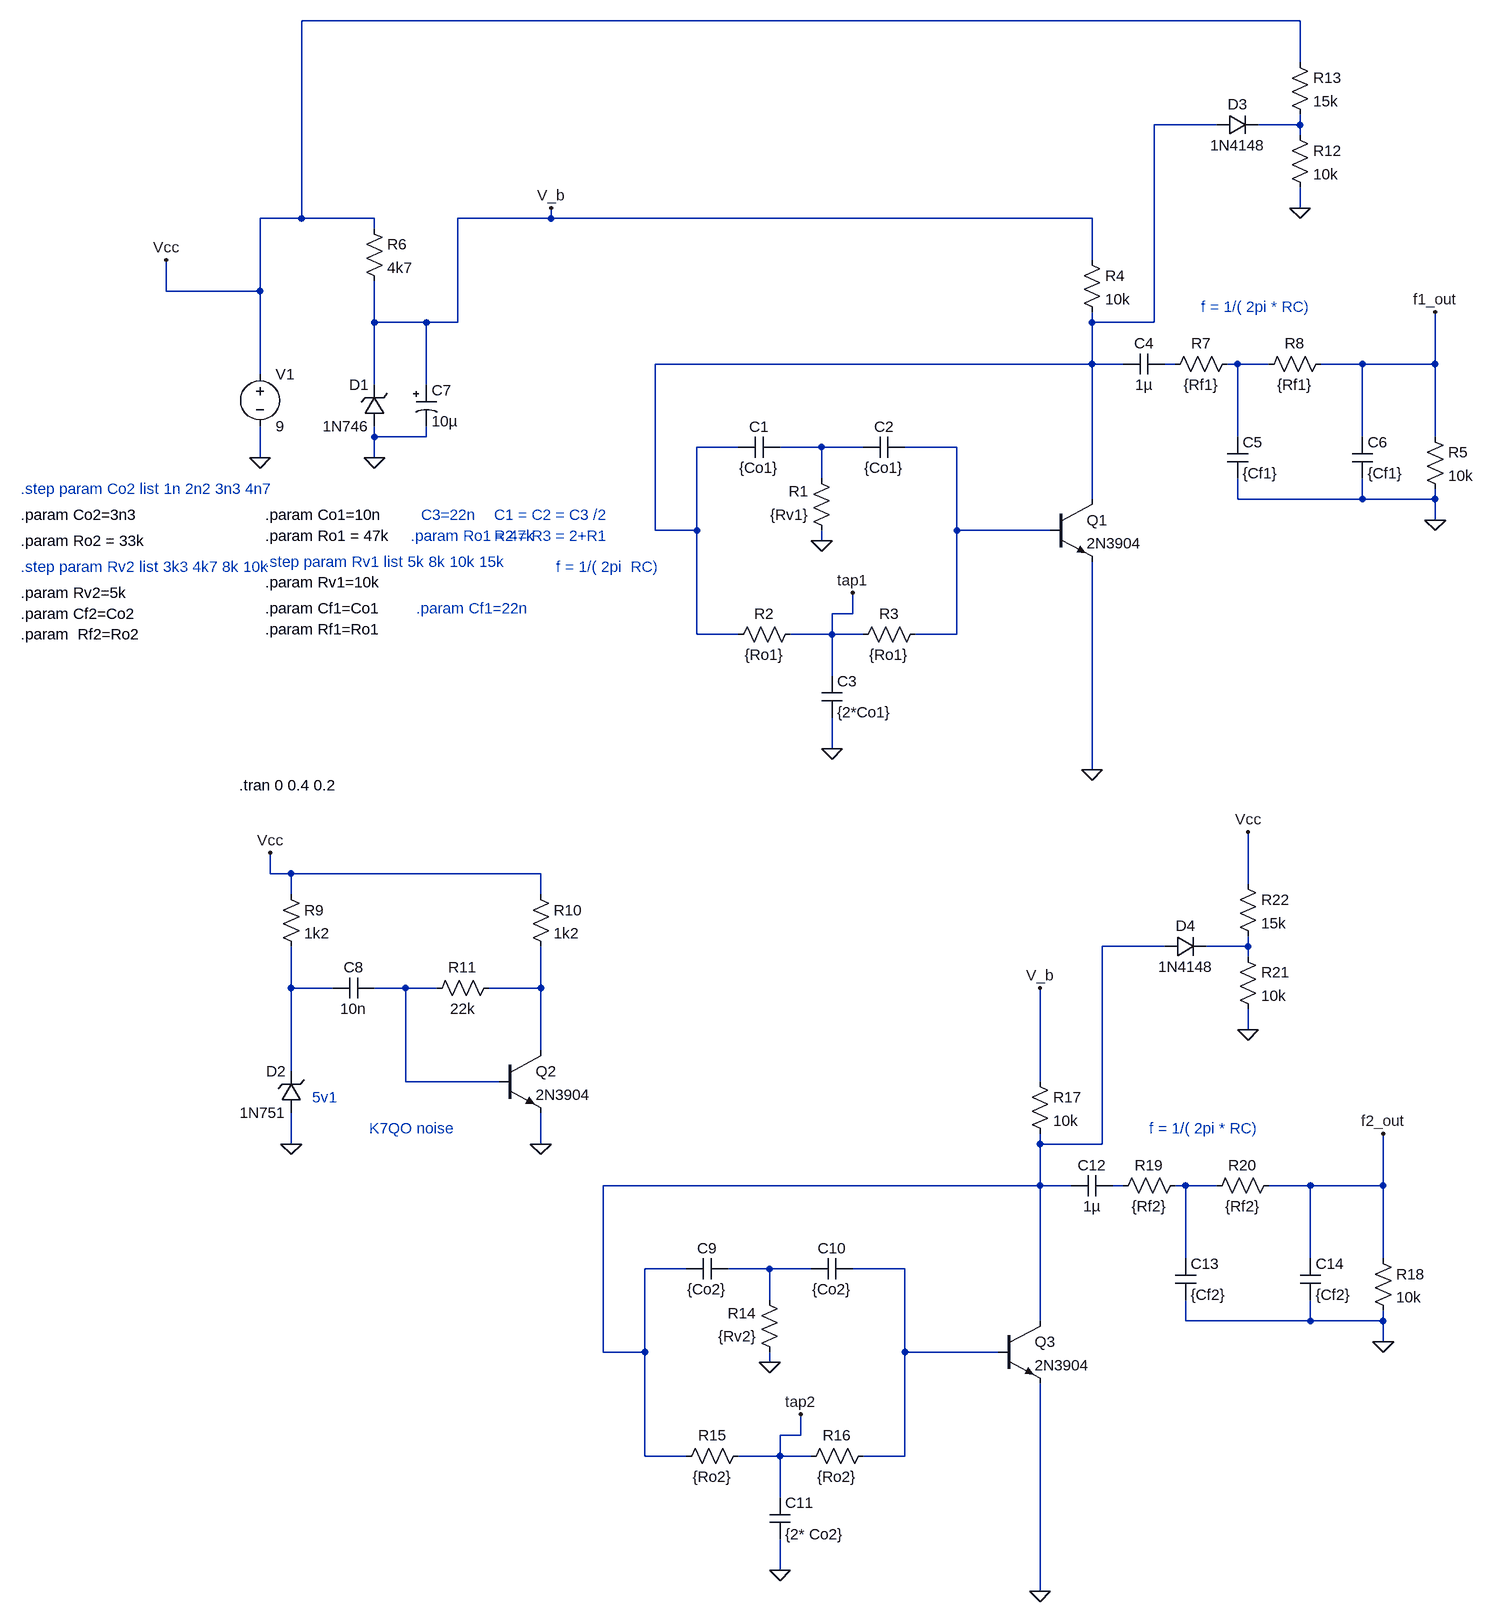
[diagram p0: schematic twin-t-osc-0v03.asc]
twin-t-osc-0v03.asc, the LTspice schematic file:
Version 4
SHEET 1 1364 1892
WIRE 1088 -544 -448 -544
WIRE 1088 -480 1088 -544
WIRE 960 -384 864 -384
WIRE 1088 -384 1088 -400
WIRE 1088 -384 1024 -384
WIRE 1088 -368 1088 -384
WIRE 1088 -256 1088 -288
WIRE -448 -240 -448 -544
WIRE -448 -240 -512 -240
WIRE -336 -240 -448 -240
WIRE -64 -240 -64 -256
WIRE -64 -240 -208 -240
WIRE 768 -240 -64 -240
WIRE -336 -224 -336 -240
WIRE 768 -176 768 -240
WIRE -656 -128 -656 -176
WIRE -512 -128 -512 -240
WIRE -512 -128 -656 -128
WIRE -336 -80 -336 -144
WIRE -256 -80 -336 -80
WIRE -208 -80 -208 -240
WIRE -208 -80 -256 -80
WIRE 768 -80 768 -96
WIRE 864 -80 864 -384
WIRE 864 -80 768 -80
WIRE 768 -16 768 -80
WIRE 768 -16 96 -16
WIRE 816 -16 768 -16
WIRE 896 -16 880 -16
WIRE 992 -16 976 -16
WIRE 1040 -16 992 -16
WIRE 1184 -16 1120 -16
WIRE 1296 -16 1296 -96
WIRE 1296 -16 1184 -16
WIRE -512 0 -512 -128
WIRE -336 16 -336 -80
WIRE -256 16 -256 -80
WIRE -336 96 -336 80
WIRE -256 96 -256 80
WIRE -256 96 -336 96
WIRE 992 96 992 -16
WIRE 1184 96 1184 -16
WIRE 1296 96 1296 -16
WIRE 224 112 160 112
WIRE 352 112 288 112
WIRE 416 112 352 112
WIRE 560 112 480 112
WIRE -512 128 -512 80
WIRE -336 128 -336 96
WIRE 352 160 352 112
WIRE 768 192 768 -16
WIRE 992 192 992 160
WIRE 1184 192 1184 160
WIRE 1184 192 992 192
WIRE 1296 192 1296 176
WIRE 1296 192 1184 192
WIRE 1296 224 1296 192
WIRE 96 240 96 -16
WIRE 160 240 160 112
WIRE 160 240 96 240
WIRE 560 240 560 112
WIRE 704 240 560 240
WIRE 352 256 352 240
WIRE 400 368 400 336
WIRE 400 368 368 368
WIRE 160 400 160 240
WIRE 224 400 160 400
WIRE 368 400 368 368
WIRE 368 400 304 400
WIRE 416 400 368 400
WIRE 560 400 560 240
WIRE 560 400 496 400
WIRE 368 464 368 400
WIRE 368 576 368 528
WIRE 768 608 768 288
WIRE -496 768 -496 736
WIRE -464 768 -496 768
WIRE -80 768 -464 768
WIRE 1008 784 1008 704
WIRE -464 800 -464 768
WIRE -80 800 -80 768
WIRE 880 880 784 880
WIRE 1008 880 1008 864
WIRE 1008 880 944 880
WIRE 1008 896 1008 880
WIRE -464 944 -464 880
WIRE -400 944 -464 944
WIRE -288 944 -336 944
WIRE -240 944 -288 944
WIRE -80 944 -80 880
WIRE -80 944 -160 944
WIRE 1008 1008 1008 976
WIRE -80 1040 -80 944
WIRE -464 1072 -464 944
WIRE -288 1088 -288 944
WIRE -144 1088 -288 1088
WIRE 688 1088 688 944
WIRE -464 1184 -464 1136
WIRE -80 1184 -80 1136
WIRE 688 1184 688 1168
WIRE 784 1184 784 880
WIRE 784 1184 688 1184
WIRE 688 1248 688 1184
WIRE 688 1248 16 1248
WIRE 736 1248 688 1248
WIRE 816 1248 800 1248
WIRE 912 1248 896 1248
WIRE 960 1248 912 1248
WIRE 1104 1248 1040 1248
WIRE 1216 1248 1216 1168
WIRE 1216 1248 1104 1248
WIRE 912 1360 912 1248
WIRE 1104 1360 1104 1248
WIRE 1216 1360 1216 1248
WIRE 144 1376 80 1376
WIRE 272 1376 208 1376
WIRE 336 1376 272 1376
WIRE 480 1376 400 1376
WIRE 272 1424 272 1376
WIRE 688 1456 688 1248
WIRE 912 1456 912 1424
WIRE 1104 1456 1104 1424
WIRE 1104 1456 912 1456
WIRE 1216 1456 1216 1440
WIRE 1216 1456 1104 1456
WIRE 1216 1488 1216 1456
WIRE 16 1504 16 1248
WIRE 80 1504 80 1376
WIRE 80 1504 16 1504
WIRE 480 1504 480 1376
WIRE 624 1504 480 1504
WIRE 272 1520 272 1504
WIRE 320 1632 320 1600
WIRE 320 1632 288 1632
WIRE 80 1664 80 1504
WIRE 144 1664 80 1664
WIRE 288 1664 288 1632
WIRE 288 1664 224 1664
WIRE 336 1664 288 1664
WIRE 480 1664 480 1504
WIRE 480 1664 416 1664
WIRE 288 1728 288 1664
WIRE 288 1840 288 1792
WIRE 688 1872 688 1552
FLAG 352 256 0
FLAG 368 576 0
FLAG -512 128 0
FLAG 768 608 0
FLAG 1296 -96 f1_out
FLAG 400 336 tap1
FLAG 1296 224 0
FLAG -336 128 0
FLAG -464 1184 0
FLAG -656 -176 Vcc
FLAG -496 736 Vcc
FLAG -80 1184 0
FLAG 1088 -256 0
FLAG -64 -256 V_b
FLAG 272 1520 0
FLAG 288 1840 0
FLAG 688 1872 0
FLAG 1216 1168 f2_out
FLAG 320 1600 tap2
FLAG 1216 1488 0
FLAG 1008 1008 0
FLAG 688 944 V_b
FLAG 1008 704 Vcc
SYMBOL cap 288 96 R90
WINDOW 0 0 32 VBottom 2
WINDOW 3 32 32 VTop 2
SYMATTR InstName C1
SYMATTR Value {Co1}
SYMBOL cap 480 96 R90
WINDOW 0 0 32 VBottom 2
WINDOW 3 32 32 VTop 2
SYMATTR InstName C2
SYMATTR Value {Co1}
SYMBOL res 368 256 R180
WINDOW 0 36 76 Left 2
WINDOW 3 36 40 Left 2
SYMATTR InstName R1
SYMATTR Value {Rv1}
SYMBOL res 320 384 R90
WINDOW 0 0 56 VBottom 2
WINDOW 3 32 56 VTop 2
SYMATTR InstName R2
SYMATTR Value {Ro1}
SYMBOL cap 352 464 R0
SYMATTR InstName C3
SYMATTR Value {2*Co1}
SYMBOL res 512 384 R90
WINDOW 0 0 56 VBottom 2
WINDOW 3 32 56 VTop 2
SYMATTR InstName R3
SYMATTR Value {Ro1}
SYMBOL npn 704 192 R0
SYMATTR InstName Q1
SYMATTR Value 2N3904
SYMBOL res 752 -192 R0
SYMATTR InstName R4
SYMATTR Value 10k
SYMBOL voltage -512 -16 R0
WINDOW 123 0 0 Left 2
WINDOW 39 0 0 Left 2
SYMATTR InstName V1
SYMATTR Value 9
SYMBOL cap 880 -32 R90
WINDOW 0 0 32 VBottom 2
WINDOW 3 32 32 VTop 2
SYMATTR InstName C4
SYMATTR Value 1µ
SYMBOL res 1280 80 R0
SYMATTR InstName R5
SYMATTR Value 10k
SYMBOL zener -320 80 R180
WINDOW 0 24 64 Left 2
WINDOW 3 24 0 Left 2
SYMATTR InstName D1
SYMATTR Value 1N746
SYMBOL res -352 -240 R0
SYMATTR InstName R6
SYMATTR Value 4k7
SYMBOL res 992 -32 R90
WINDOW 0 0 56 VBottom 2
WINDOW 3 32 56 VTop 2
SYMATTR InstName R7
SYMATTR Value {Rf1}
SYMBOL res 1136 -32 R90
WINDOW 0 0 56 VBottom 2
WINDOW 3 32 56 VTop 2
SYMATTR InstName R8
SYMATTR Value {Rf1}
SYMBOL cap 976 96 R0
SYMATTR InstName C5
SYMATTR Value {Cf1}
SYMBOL cap 1168 96 R0
SYMATTR InstName C6
SYMATTR Value {Cf1}
SYMBOL polcap -272 16 R0
SYMATTR InstName C7
SYMATTR Value 10µ
SYMBOL zener -448 1136 R180
WINDOW 0 24 64 Left 2
WINDOW 3 24 0 Left 2
SYMATTR InstName D2
SYMATTR Value 1N751
SYMBOL res -480 784 R0
SYMATTR InstName R9
SYMATTR Value 1k2
SYMBOL cap -400 928 M90
WINDOW 0 0 32 VBottom 2
WINDOW 3 32 32 VTop 2
SYMATTR InstName C8
SYMATTR Value 10n
SYMBOL npn -144 1040 R0
SYMATTR InstName Q2
SYMATTR Value 2N3904
SYMBOL res -96 784 R0
SYMATTR InstName R10
SYMATTR Value 1k2
SYMBOL res -144 928 R90
WINDOW 0 0 56 VBottom 2
WINDOW 3 32 56 VTop 2
SYMATTR InstName R11
SYMATTR Value 22k
SYMBOL res 1072 -384 R0
SYMATTR InstName R12
SYMATTR Value 10k
SYMBOL res 1072 -496 R0
SYMATTR InstName R13
SYMATTR Value 15k
SYMBOL diode 960 -368 R270
WINDOW 0 32 32 VTop 2
WINDOW 3 0 32 VBottom 2
SYMATTR InstName D3
SYMATTR Value 1N4148
SYMBOL cap 208 1360 R90
WINDOW 0 0 32 VBottom 2
WINDOW 3 32 32 VTop 2
SYMATTR InstName C9
SYMATTR Value {Co2}
SYMBOL cap 400 1360 R90
WINDOW 0 0 32 VBottom 2
WINDOW 3 32 32 VTop 2
SYMATTR InstName C10
SYMATTR Value {Co2}
SYMBOL res 288 1520 R180
WINDOW 0 36 76 Left 2
WINDOW 3 36 40 Left 2
SYMATTR InstName R14
SYMATTR Value {Rv2}
SYMBOL res 240 1648 R90
WINDOW 0 0 56 VBottom 2
WINDOW 3 32 56 VTop 2
SYMATTR InstName R15
SYMATTR Value {Ro2}
SYMBOL cap 272 1728 R0
SYMATTR InstName C11
SYMATTR Value {2* Co2}
SYMBOL res 432 1648 R90
WINDOW 0 0 56 VBottom 2
WINDOW 3 32 56 VTop 2
SYMATTR InstName R16
SYMATTR Value {Ro2}
SYMBOL npn 624 1456 R0
SYMATTR InstName Q3
SYMATTR Value 2N3904
SYMBOL res 672 1072 R0
SYMATTR InstName R17
SYMATTR Value 10k
SYMBOL cap 800 1232 R90
WINDOW 0 0 32 VBottom 2
WINDOW 3 32 32 VTop 2
SYMATTR InstName C12
SYMATTR Value 1µ
SYMBOL res 1200 1344 R0
SYMATTR InstName R18
SYMATTR Value 10k
SYMBOL res 912 1232 R90
WINDOW 0 0 56 VBottom 2
WINDOW 3 32 56 VTop 2
SYMATTR InstName R19
SYMATTR Value {Rf2}
SYMBOL res 1056 1232 R90
WINDOW 0 0 56 VBottom 2
WINDOW 3 32 56 VTop 2
SYMATTR InstName R20
SYMATTR Value {Rf2}
SYMBOL cap 896 1360 R0
SYMATTR InstName C13
SYMATTR Value {Cf2}
SYMBOL cap 1088 1360 R0
SYMATTR InstName C14
SYMATTR Value {Cf2}
SYMBOL res 992 880 R0
SYMATTR InstName R21
SYMATTR Value 10k
SYMBOL res 992 768 R0
SYMATTR InstName R22
SYMATTR Value 15k
SYMBOL diode 880 896 R270
WINDOW 0 32 32 VTop 2
WINDOW 3 0 32 VBottom 2
SYMATTR InstName D4
SYMATTR Value 1N4148
TEXT -152 248 Left 2 ;R2 = R3 = 2+R1
TEXT -544 632 Left 2 !.tran 0 0.4 0.2
TEXT -504 288 Left 2 ;.step param Rv1 list 5k 8k 10k 15k
TEXT -56 296 Left 2 ;f = 1/( 2pi  RC)
TEXT -152 216 Left 2 ;C1 = C2 = C3 /2
TEXT -432 1112 Left 2 ;5v1
TEXT -344 1160 Left 2 ;K7QO noise
TEXT 936 -104 Left 2 ;f = 1/( 2pi * RC)
TEXT -504 248 Left 2 !.param Ro1 = 47k
TEXT -504 216 Left 2 !.param Co1=10n
TEXT 856 1160 Left 2 ;f = 1/( 2pi * RC)
TEXT -880 296 Left 2 ;.step param Rv2 list 3k3 4k7 8k 10k
TEXT -880 256 Left 2 !.param Ro2 = 33k
TEXT -880 176 Left 2 ;.step param Co2 list 1n 2n2 3n3 4n7
TEXT -880 368 Left 2 !.param Cf2=Co2
TEXT -272 360 Left 2 ;.param Cf1=22n
TEXT -504 392 Left 2 !.param Rf1=Ro1
TEXT -880 400 Left 2 !.param  Rf2=Ro2
TEXT -880 336 Left 2 !.param Rv2=5k
TEXT -504 320 Left 2 !.param Rv1=10k
TEXT -504 360 Left 2 !.param Cf1=Co1
TEXT -264 216 Left 2 ;C3=22n
TEXT -880 216 Left 2 !.param Co2=3n3
TEXT -280 248 Left 2 ;.param Ro1 = 47k

The netlist it stands for:
* twin-t-osc-0v03.asc
C1 N005 N001 {Co1}
C2 N006 N005 {Co1}
R1 0 N005 {Rv1}
R2 tap1 N001 {Ro1}
C3 tap1 0 {2*Co1}
R3 N006 tap1 {Ro1}
Q1 N001 N006 0 0 2N3904
R4 V_b N001 10k
V1 Vcc 0 9
C4 N003 N001 1µ
R5 f1_out 0 10k
D1 0 V_b 1N746
R6 Vcc V_b 4k7
R7 N004 N003 {Rf1}
R8 f1_out N004 {Rf1}
C5 N004 0 {Cf1}
C6 f1_out 0 {Cf1}
C7 V_b 0 10µ
D2 0 N009 1N751
R9 Vcc N009 1k2
C8 N009 N010 10n
Q2 N011 N010 0 0 2N3904
R10 Vcc N011 1k2
R11 N011 N010 22k
R12 N002 0 10k
R13 Vcc N002 15k
D3 N001 N002 1N4148
C9 N014 N007 {Co2}
C10 N015 N014 {Co2}
R14 0 N014 {Rv2}
R15 tap2 N007 {Ro2}
C11 tap2 0 {2* Co2}
R16 N015 tap2 {Ro2}
Q3 N007 N015 0 0 2N3904
R17 V_b N007 10k
C12 N012 N007 1µ
R18 f2_out 0 10k
R19 N013 N012 {Rf2}
R20 f2_out N013 {Rf2}
C13 N013 0 {Cf2}
C14 f2_out 0 {Cf2}
R21 N008 0 10k
R22 Vcc N008 15k
D4 N007 N008 1N4148
.model D D
.lib standard.dio
.model NPN NPN
.model PNP PNP
.lib standard.bjt
* R2 = R3 = 2+R1
.tran 0 0.4 0.2
* .step param Rv1 list 5k 8k 10k 15k
* f = 1/( 2pi  RC)
* C1 = C2 = C3 /2
* 5v1
* K7QO noise
* f = 1/( 2pi * RC)
.param Ro1 = 47k
.param Co1=10n
* f = 1/( 2pi * RC)
* .step param Rv2 list 3k3 4k7 8k 10k
.param Ro2 = 33k
* .step param Co2 list 1n 2n2 3n3 4n7
.param Cf2=Co2
* .param Cf1=22n
.param Rf1=Ro1
.param  Rf2=Ro2
.param Rv2=5k
.param Rv1=10k
.param Cf1=Co1
* C3=22n
.param Co2=3n3
* .param Ro1 = 47k
.backanno
.end